# EAGLE schematic mapleCUx_large_088-Stripped (EAGLE 7.3.0)
MAPLE-CUx Large Version
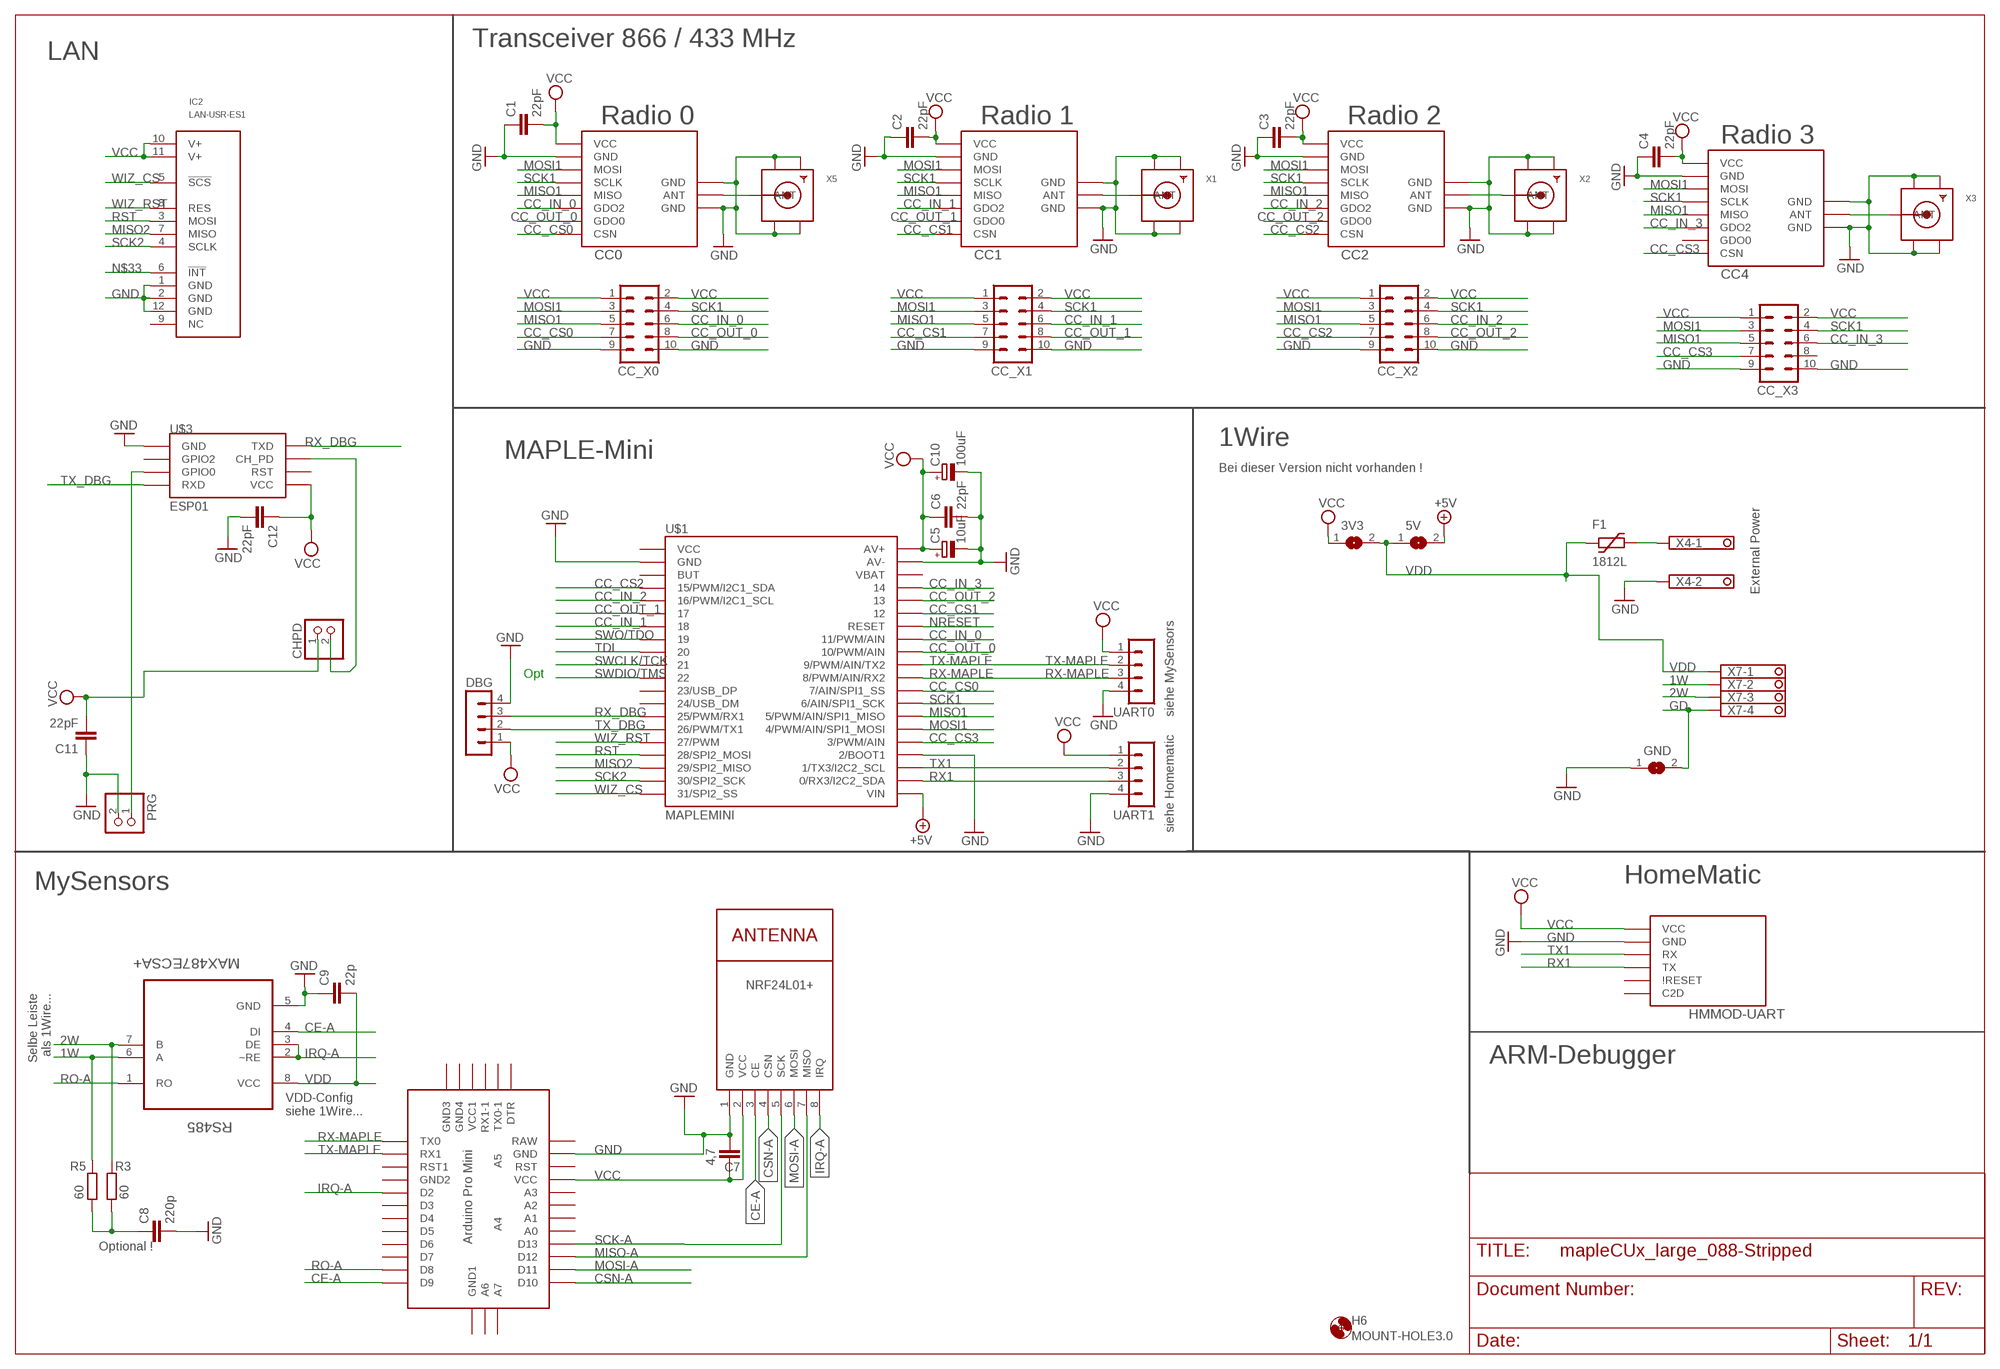
[diagram p0: schematic, sheet 1]

## Parts
3V3  SJ  [SJ]
5V  SJ  [SJ]
C1  22pF  C-EUC0805  [C0805]
C2  22pF  C-EUC0805  [C0805]
C3  22pF  C-EUC0805  [C0805]
C4  22pF  C-EUC0805  [C0805]
C5  10uF  CPOL-EUR/2012-12W  [R/2012-12W]
C6  22pF  C-EUC0805  [C0805]
C7  4,7  C-EUC1210  [C1210]
C8  220p  C-EUC0805  [C0805]
C9  22p  C-EUC0805  [C0805]
C10  100uF  CPOL-EUE5-8.5  [E5-8,5]
C11  22pF  C-EUC0805  [C0805]
C12  22pF  C-EUC0805  [C0805]
CC0  CC1101  CC1101_MODULE1SMD  [CC1101_MODULE1_SMD]
CC1  CC1101_MODULE1SMD  [CC1101_MODULE1_SMD]
CC2  CC1101_MODULE1SMD  [CC1101_MODULE1_SMD]
CC4  CC1101_MODULE1SMD  [CC1101_MODULE1_SMD]
CC_X0  MA05-2  [MA05-2]
CC_X1  MA05-2  [MA05-2]
CC_X2  MA05-2  [MA05-2]
CC_X3  MA05-2  [MA05-2]
CHPD  PINHD-1X2  [1X02]
DBG  MA04-1  [MA04-1]
F1  1812L  [1812L]
GND  SJ  [SJ]
H6  MOUNT-HOLE3.0  [3,0]
HMMOD-UART  HM-MOD-UARTDIL  [HM-MOD-UART-DIL]
IC2  LAN-USR-ES1  [USR-ES1]
NRF24L01+  NRF24L01+  WIRELESS-NRF24L01  [WIRELESS-NRF24L01]
PRG  PINHD-1X2  [1X02]
R3  60  R-EU_R0805  [R0805]
R5  60  R-EU_R0805  [R0805]
RS485  MAX487ECSA+  [SOIC127P600X175-8N]
U$1  MAPLEMINI  [20-DIP]
U$2  ABK-PRO-MINI  [ABK-PRO-MINI]
U$3  ESP01  [ESP01]
UART0  MA04-1  [MA04-1]
UART1  MA04-1  [MA04-1]
X1  SMACONNECTOR_EDGE_UFL  [SMA_EDGELAUNCH_UFL]
X2  SMACONNECTOR_EDGE_UFL  [SMA_EDGELAUNCH_UFL]
X3  SMACONNECTOR_EDGE_UFL  [SMA_EDGELAUNCH_UFL]
X4  1751248  [1751248]
X5  SMACONNECTOR_EDGE_UFL  [SMA_EDGELAUNCH_UFL]
X7  1751264  [1751264]

## Nets
1W: R5.2 RS485.6(A) X7.2
2W: R3.2 RS485.7(B) X7.3
+5V [PWR]: 5V.2 U$1.21(VIN)
CC_CS0: CC0.CSN CC_X0.7 U$1.29(7/AIN/SPI1_SS)
CC_CS1: CC1.CSN CC_X1.7 U$1.35
CC_CS2: CC2.CSN CC_X2.7 U$1.4(15/PWM/I2C1_SDA)
CC_CS3: CC4.CSN CC_X3.7 U$1.25(3/PWM/AIN)
CC_IN_0: CC0.GDO2 CC_X0.6 U$1.33(11/PWM/AIN)
CC_IN_1: CC1.GDO2 CC_X1.6 U$1.7
CC_IN_2: CC2.GDO2 CC_X2.6 U$1.5(16/PWM/I2C1_SCL)
CC_IN_3: CC4.GDO2 CC_X3.6 U$1.37
CC_OUT_0: CC0.GDO0 CC_X0.8 U$1.32(10/PWM/AIN)
CC_OUT_1: CC1.GDO0 CC_X1.8 U$1.6
CC_OUT_2: CC2.GDO0 CC_X2.8 U$1.36
CE-A: NRF24L01+.3(CE) RS485.4(DI) U$2.D9
CSN-A: NRF24L01+.4(CSN) U$2.D10
GD [PWR]: GND.2 X7.4
GND [PWR]: C1.1 C2.1 C3.1 C4.1 C5.- C6.2 C7.1 C8.2 C9.1 C10.- C11.1 C12.2 CC0.GND@0(GND) CC0.GND@1(GND) CC0.GND@2(GND) CC1.GND@0(GND) CC1.GND@1(GND) CC1.GND@2(GND) CC2.GND@0(GND) CC2.GND@1(GND) CC2.GND@2(GND) CC4.GND@0(GND) CC4.GND@1(GND) CC4.GND@2(GND) CC_X0.9 CC_X0.10 CC_X1.9 CC_X1.10 CC_X2.9 CC_X2.10 CC_X3.9 CC_X3.10 DBG.4 GND.1 HMMOD-UART.2(GND) IC2.1(GND) IC2.2(GND) IC2.12(GND) NRF24L01+.1(GND) PRG.2 RS485.5(GND) U$1.2(GND) U$1.24(2/BOOT1) U$1.39(AV-) U$2.GND U$3.GND UART0.4 UART1.4 X1.GND@1(GND1) X1.GND@2(GND2) X1.GND@3(GND3) X1.GND@4(GND4) X2.GND@1(GND1) X2.GND@2(GND2) X2.GND@3(GND3) X2.GND@4(GND4) X3.GND@1(GND1) X3.GND@2(GND2) X3.GND@3(GND3) X3.GND@4(GND4) X4.2 X5.GND@1(GND1) X5.GND@2(GND2) X5.GND@3(GND3) X5.GND@4(GND4)
IRQ-A: NRF24L01+.8(IRQ) RS485.2(~RE) RS485.3(DE) U$2.D2
MISO1: CC0.MISO CC1.MISO CC2.MISO CC4.MISO CC_X0.5 CC_X1.5 CC_X2.5 CC_X3.5 U$1.27(5/PWM/AIN/SPI1_MISO)
MISO2: IC2.7(MISO) U$1.18(29/SPI2_MISO)
MISO-A: NRF24L01+.7(MISO) U$2.D12
MOSI1: CC0.MOSI CC1.MOSI CC2.MOSI CC4.MOSI CC_X0.3 CC_X1.3 CC_X2.3 CC_X3.3 U$1.26(4/PWM/AIN/SPI1_MOSI)
MOSI-A: NRF24L01+.6(MOSI) U$2.D11
N$1: CC1.ANT X1.P(ANT)
N$2: CC4.ANT X3.P(ANT)
N$3: CC2.ANT X2.P(ANT)
N$4: CC0.ANT X5.P(ANT)
N$11: PRG.1 U$3.GPIO0
N$17: CHPD.2 U$3.CH_PD
N$21: C8.1 R3.1 R5.1
N$33: IC2.6(!INT!)
N$45 [PWR]: F1.P$2 X4.1
NRESET: U$1.34(RESET)
RO-A: RS485.1(RO) U$2.D8
RST: IC2.3(MOSI) U$1.17(28/SPI2_MOSI)
RX1: HMMOD-UART.5(TX) U$1.22(0/RX3/I2C2_SDA) UART1.3
RX-MAPLE: U$1.30(8/PWM/AIN/RX2) U$2.TX0 UART0.3
RX_DBG: DBG.3 U$1.14(25/PWM/RX1) U$3.TX(TXD)
SCK1: CC0.SCLK CC1.SCLK CC2.SCLK CC4.SCLK CC_X0.4 CC_X1.4 CC_X2.4 CC_X3.4 U$1.28(6/AIN/SPI1_SCK)
SCK2: IC2.4(SCLK) U$1.19(30/SPI2_SCK)
SCK-A: NRF24L01+.5(SCK) U$2.D13
SWCLK/TCK: U$1.10
SWDIO/TMS: U$1.11
SWO/TDO: U$1.8
TDI: U$1.9
TX1: HMMOD-UART.6(RX) U$1.23(1/TX3/I2C2_SCL) UART1.2
TX-MAPLE: U$1.31(9/PWM/AIN/TX2) U$2.RX1 UART0.2
TX_DBG: DBG.2 U$1.15(26/PWM/TX1) U$3.RX(RXD)
VCC [PWR]: 3V3.1 C1.2 C2.2 C3.2 C4.2 C5.+ C6.1 C7.2 C10.+ C11.2 C12.1 CC0.VCC CC1.VCC CC2.VCC CC4.VCC CC_X0.1 CC_X0.2 CC_X1.1 CC_X1.2 CC_X2.1 CC_X2.2 CC_X3.1 CC_X3.2 CHPD.1 DBG.1 HMMOD-UART.1(VCC) IC2.10(V+) IC2.11(V+) NRF24L01+.2(VCC) U$1.40(AV+) U$2.VCC U$3.VCC UART0.1 UART1.1
VDD [PWR]: 3V3.2 5V.1 C9.2 F1.P$1 RS485.8(VCC) X7.1
WIZ_CS: IC2.5(!SCS!) U$1.20(31/SPI2_SS)
WIZ_RST: IC2.8(RES) U$1.16(27/PWM)
Unconnected: CC4.GDO0 CC_X3.8 HMMOD-UART.3(C2D) HMMOD-UART.4(\!RESET) IC2.9(NC) U$1.1(VCC) U$1.3(BUT) U$1.12(23/USB_DP) U$1.13(24/USB_DM) U$1.38(VBAT) U$2.A0 U$2.A1 U$2.A2 U$2.A3 U$2.A4 U$2.A5 U$2.A6 U$2.A7 U$2.D3 U$2.D4 U$2.D5 U$2.D6 U$2.D7 U$2.DTR U$2.GND1(GND2) U$2.GND2(GND3) U$2.GND3(GND4) U$2.GND4(GND1) U$2.RAW U$2.RST U$2.RST1 U$2.RX1-1 U$2.TX0-1 U$2.VCC1 U$3.GPIO2 U$3.RST

## Notes on the sheet
- Transceiver 866 / 433 MHz
- LAN
- Radio 0 | Radio 1 | Radio 2
- Radio 3
- 1Wire
- MAPLE-Mini
- Bei dieser Version nicht vorhanden !
- External Power
- Opt
- siehe MySensors
- siehe Homematic
- MySensors | HomeMatic
- Selbe Leiste
  als 1Wire...
- ARM-Debugger
- VDD-Config
  siehe 1Wire...
- Optional !

## Library data of the parts
3V3 5V GND = jumper:SJ: SMD solder JUMPER
C1-C4 C6-C9 C11 C12 = rcl:C-EU: CAPACITOR, European symbol
C5 C10 = rcl:CPOL-EU: POLARIZED CAPACITOR, European symbol
CC0 CC1 CC2 CC4 = wireless:CC1101_MODULE1: CC1101 wireless module for 433/868 MHz (sold from Aliexpress). DIL version for mounting with pin header (and SMD soldering) and SMD only variant available.
CC_X0 CC_X1-CC_X3 = con-lstb:MA05-2: PIN HEADER; OC_FARNELL: unknown; OC_NEWARK: unknown
CHPD PRG = pinhead:PINHD-1X2: PIN HEADER
DBG UART0 UART1 = con-lstb:MA04-1: PIN HEADER; OC_FARNELL: unknown; OC_NEWARK: unknown
F1 = ptc-littlefuse:1812L
H6 = holes:MOUNT-HOLE: MOUNTING HOLE with drill center marker
HMMOD-UART = wireless:HM-MOD-UART: eQ3 HM-MOD-UART-AW-SH2 wireless module for 868 MHz. DIL version for mounting with pin header (antenna upwards) and SMD variant available (antenna downwards).
IC2 = Martin-Communication:LAN-USR-ES1
NRF24L01+ = diy-modules:WIRELESS-NRF24L01: 2.4 GHz Wireless Module based on NRF24L01 chip
R3 R5 = rcl:R-EU_: RESISTOR, European symbol
RS485 = Maxim_By_element14_Batch_1:MAX487ECSA+: Low-Power, Slew-Rate-Limited RS-485/RS-422 Transceivers; MPN: MAX487ECSA+; OC_FARNELL: 9724532; OC_NEWARK: 68K4803; PACKAGE: SOIC-8; SUPPLIER: Maxim
U$1 = maplemini-small:MAPLEMINI
U$2 = Arduino-clone:ABK-PRO-MINI: ABK Pro-Mini Arduino Clone
U$3 = esp8266modules:ESP01: ESP8266 Wifi module 01
X1-X3 X5 = adafruit:SMACONNECTOR: SMA Connector 90° DIP SMA Connector, 50 Ohm (4UConnector: 07259)
X4 = con-phoenix-350:1751248: MKDS 1/ 2-3,5 Printklemme Nennstrom: 10 A Bemessungsspannung: 160 V Raster: 3,5 mm Polzahl: 2 Montageart: Löten Anschlussart: Schraubanschluss Anschlussrichtung vom Leiter zur Platine: 0° Source: http://eshop.phoenixcontact.com .. 1751248.pdf; OC_FARNELL: unknown; OC_NEWARK: unknown
X7 = con-phoenix-350:1751264: MKDS 1/ 4-3,5 Printklemme Nennstrom: 10 A Bemessungsspannung: 160 V Raster: 3,5 mm Polzahl: 4 Montageart: Löten Anschlussart: Schraubanschluss Anschlussrichtung vom Leiter zur Platine: 0° Source: http://eshop.phoenixcontact.com .. 1751264.pdf; MPN: 1751264; OC_FARNELL: unknown; OC_NEWARK: 10R0934

## Net classes
0 default: width 0.305 mm
1 PWR: width 0.457 mm